# EAGLE design DriverBoard (EAGLE 5.10)
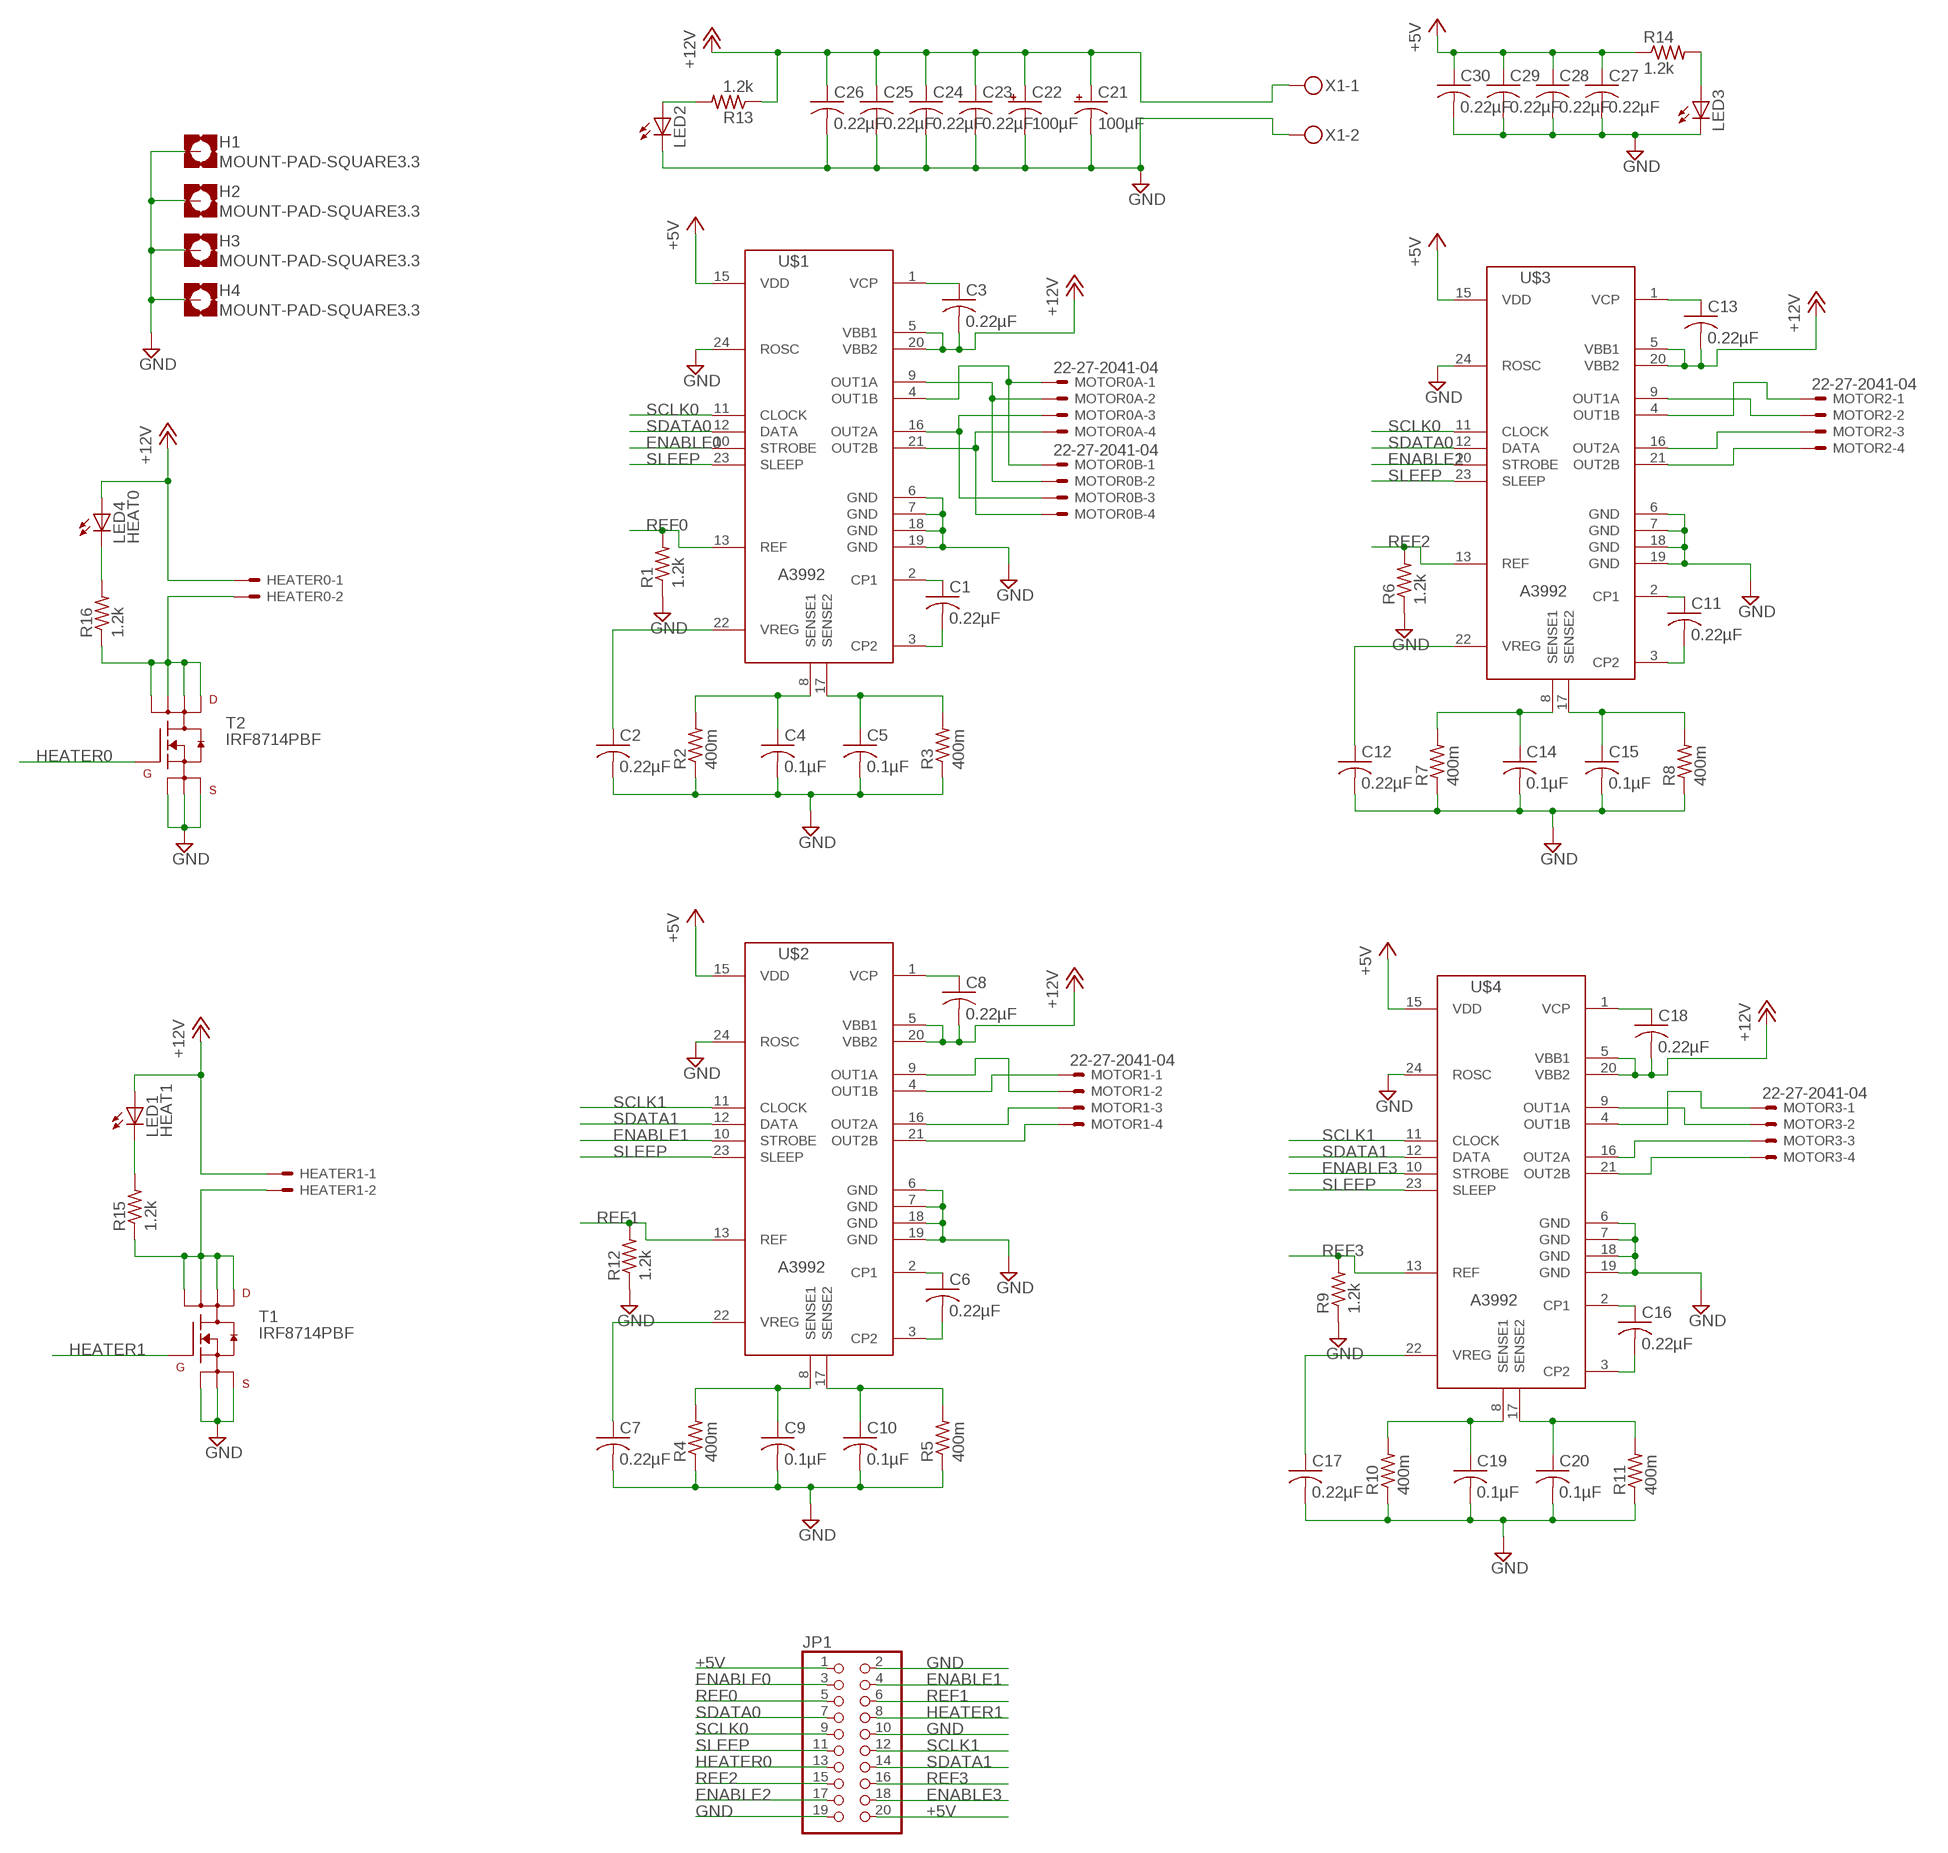
[diagram p0: schematic, sheet 1]

## Parts
C1  0.22µF  C-US050-025X075  [C050-025X075]
C2  0.22µF  C-US050-025X075  [C050-025X075]
C3  0.22µF  C-US050-025X075  [C050-025X075]
C4  0.1µF  C-US050-025X075  [C050-025X075]
C5  0.1µF  C-US050-025X075  [C050-025X075]
C6  0.22µF  C-US050-025X075  [C050-025X075]
C7  0.22µF  C-US050-025X075  [C050-025X075]
C8  0.22µF  C-US050-025X075  [C050-025X075]
C9  0.1µF  C-US050-025X075  [C050-025X075]
C10  0.1µF  C-US050-025X075  [C050-025X075]
C11  0.22µF  C-US050-025X075  [C050-025X075]
C12  0.22µF  C-US050-025X075  [C050-025X075]
C13  0.22µF  C-US050-025X075  [C050-025X075]
C14  0.1µF  C-US050-025X075  [C050-025X075]
C15  0.1µF  C-US050-025X075  [C050-025X075]
C16  0.22µF  C-US050-025X075  [C050-025X075]
C17  0.22µF  C-US050-025X075  [C050-025X075]
C18  0.22µF  C-US050-025X075  [C050-025X075]
C19  0.1µF  C-US050-025X075  [C050-025X075]
C20  0.1µF  C-US050-025X075  [C050-025X075]
C21  100µF  CPOL-USE7.5-16  [E7,5-16]
C22  100µF  CPOL-USE7.5-16  [E7,5-16]
C23  0.22µF  C-US050-025X075  [C050-025X075]
C24  0.22µF  C-US050-025X075  [C050-025X075]
C25  0.22µF  C-US050-025X075  [C050-025X075]
C26  0.22µF  C-US050-025X075  [C050-025X075]
C27  0.22µF  C-US050-025X075  [C050-025X075]
C28  0.22µF  C-US050-025X075  [C050-025X075]
C29  0.22µF  C-US050-025X075  [C050-025X075]
C30  0.22µF  C-US050-025X075  [C050-025X075]
H1  MOUNT-PAD-SQUARE3.3  [3,3-PAD-SQUARE]
H2  MOUNT-PAD-SQUARE3.3  [3,3-PAD-SQUARE]
H3  MOUNT-PAD-SQUARE3.3  [3,3-PAD-SQUARE]
H4  MOUNT-PAD-SQUARE3.3  [3,3-PAD-SQUARE]
HEATER0  22-23-2021  [22-23-2021]
HEATER1  22-23-2021  [22-23-2021]
JP1  PINHD-2X10  [2X10]
LED1  HEAT1  LED5MM  [LED5MM]
LED2  LED5MM  [LED5MM]
LED3  LED5MM  [LED5MM]
LED4  HEAT0  LED5MM  [LED5MM]
MOTOR0A  22-27-2041-04  [6410-04]
MOTOR0B  22-27-2041-04  [6410-04]
MOTOR1  22-27-2041-04  [6410-04]
MOTOR2  22-27-2041-04  [6410-04]
MOTOR3  22-27-2041-04  [6410-04]
R1  1.2k  R-US_0207/7  [0207/7]
R2  400m  R-US_0414/5V  [0414V]
R3  400m  R-US_0414/5V  [0414V]
R4  400m  R-US_0414/5V  [0414V]
R5  400m  R-US_0414/5V  [0414V]
R6  1.2k  R-US_0207/7  [0207/7]
R7  400m  R-US_0414/5V  [0414V]
R8  400m  R-US_0414/5V  [0414V]
R9  1.2k  R-US_0207/7  [0207/7]
R10  400m  R-US_0414/5V  [0414V]
R11  400m  R-US_0414/5V  [0414V]
R12  1.2k  R-US_0207/7  [0207/7]
R13  1.2k  R-US_0207/7  [0207/7]
R14  1.2k  R-US_0207/7  [0207/7]
R15  1.2k  R-US_0207/7  [0207/7]
R16  1.2k  R-US_0207/7  [0207/7]
T1  IRF8714PBF  MOSFET_N_SO8  [SO-08]
T2  IRF8714PBF  MOSFET_N_SO8  [SO-08]
U$1  A3992  [DIL24]
U$2  A3992  [DIL24]
U$3  A3992  [DIL24]
U$4  A3992  [DIL24]
X1  MKDSN1,5/2-5,08  [MKDSN1,5/2-5,08]

## Nets
+5V: C27.1 C28.1 C29.1 C30.1 JP1.1 JP1.20 R14.1 U$1.15(VDD) U$2.15(VDD) U$3.15(VDD) U$4.15(VDD)
+12V: C3.2 C8.2 C13.2 C18.2 C21.+ C22.+ C23.1 C24.1 C25.1 C26.1 HEATER0.1 HEATER1.1 LED1.A LED4.A R13.1 U$1.5(VBB1) U$1.20(VBB2) U$2.5(VBB1) U$2.20(VBB2) U$3.5(VBB1) U$3.20(VBB2) U$4.5(VBB1) U$4.20(VBB2) X1.1
ENABLE0: JP1.3 U$1.10(STROBE)
ENABLE1: JP1.4 U$2.10(STROBE)
ENABLE2: JP1.17 U$3.10(STROBE)
ENABLE3: JP1.18 U$4.10(STROBE)
GND: C2.2 C4.2 C5.2 C7.2 C9.2 C10.2 C12.2 C14.2 C15.2 C17.2 C19.2 C20.2 C21.- C22.- C23.2 C24.2 C25.2 C26.2 C27.2 C28.2 C29.2 C30.2 H1.B3,3(MOUNT) H2.B3,3(MOUNT) H3.B3,3(MOUNT) H4.B3,3(MOUNT) JP1.2 JP1.10 JP1.19 LED2.K(C) LED3.K(C) R1.1 R2.1 R3.1 R4.1 R5.1 R6.1 R7.1 R8.1 R9.1 R10.1 R11.1 R12.1 T1.1(S1) T1.2(S2) T1.3(S3) T2.1(S1) T2.2(S2) T2.3(S3) U$1.6(GND) U$1.7(GND) U$1.18(GND) U$1.19(GND) U$1.24(ROSC) U$2.6(GND) U$2.7(GND) U$2.18(GND) U$2.19(GND) U$2.24(ROSC) U$3.6(GND) U$3.7(GND) U$3.18(GND) U$3.19(GND) U$3.24(ROSC) U$4.6(GND) U$4.7(GND) U$4.18(GND) U$4.19(GND) U$4.24(ROSC) X1.2
HEATER0: JP1.13 T2.4(G)
HEATER1: JP1.8 T1.4(G)
N$1: C1.1 U$1.2(CP1)
N$2: C1.2 U$1.3(CP2)
N$3: MOTOR0A.2 MOTOR0B.2 U$1.9(OUT1A)
N$4: C2.1 U$1.22(VREG)
N$5: MOTOR0A.1 MOTOR0B.1 U$1.4(OUT1B)
N$6: C5.1 R3.2 U$1.17(SENSE2)
N$7: C4.1 R2.2 U$1.8(SENSE1)
N$8: MOTOR0A.3 MOTOR0B.3 U$1.16(OUT2A)
N$9: MOTOR0A.4 MOTOR0B.4 U$1.21(OUT2B)
N$10: C10.1 R5.2 U$2.17(SENSE2)
N$11: C9.1 R4.2 U$2.8(SENSE1)
N$12: C6.1 U$2.2(CP1)
N$13: HEATER1.2 R15.1 T1.5(D1) T1.6(D2) T1.7(D3) T1.8(D4)
N$14: C6.2 U$2.3(CP2)
N$15: LED2.A R13.2
N$16: C7.1 U$2.22(VREG)
N$17: MOTOR1.1 U$2.4(OUT1B)
N$18: MOTOR1.2 U$2.9(OUT1A)
N$19: MOTOR1.3 U$2.16(OUT2A)
N$20: MOTOR1.4 U$2.21(OUT2B)
N$21: C15.1 R8.2 U$3.17(SENSE2)
N$22: C14.1 R7.2 U$3.8(SENSE1)
N$23: C11.1 U$3.2(CP1)
N$24: C11.2 U$3.3(CP2)
N$25: LED1.K(C) R15.2
N$26: C12.1 U$3.22(VREG)
N$27: MOTOR2.2 U$3.9(OUT1A)
N$28: MOTOR2.1 U$3.4(OUT1B)
N$29: MOTOR2.3 U$3.16(OUT2A)
N$30: MOTOR2.4 U$3.21(OUT2B)
N$31: C20.1 R11.2 U$4.17(SENSE2)
N$32: C19.1 R10.2 U$4.8(SENSE1)
N$33: C16.1 U$4.2(CP1)
N$34: C16.2 U$4.3(CP2)
N$35: LED3.A R14.2
N$36: C17.1 U$4.22(VREG)
N$37: MOTOR3.2 U$4.9(OUT1A)
N$38: MOTOR3.1 U$4.4(OUT1B)
N$39: MOTOR3.3 U$4.16(OUT2A)
N$40: MOTOR3.4 U$4.21(OUT2B)
N$41: HEATER0.2 R16.1 T2.5(D1) T2.6(D2) T2.7(D3) T2.8(D4)
N$42: LED4.K(C) R16.2
REF0: JP1.5 R1.2 U$1.13(REF)
REF1: JP1.6 R12.2 U$2.13(REF)
REF2: JP1.15 R6.2 U$3.13(REF)
REF3: JP1.16 R9.2 U$4.13(REF)
SCLK0: JP1.9 U$1.11(CLOCK) U$3.11(CLOCK)
SCLK1: JP1.12 U$2.11(CLOCK) U$4.11(CLOCK)
SDATA0: JP1.7 U$1.12(DATA) U$3.12(DATA)
SDATA1: JP1.14 U$2.12(DATA) U$4.12(DATA)
SLEEP: JP1.11 U$1.23(SLEEP) U$2.23(SLEEP) U$3.23(SLEEP) U$4.23(SLEEP)
VCP1: C3.1 U$1.1(VCP)
VCP2: C8.1 U$2.1(VCP)
VCP3: C13.1 U$3.1(VCP)
VCP4: C18.1 U$4.1(VCP)

## Library data of the parts
C1-C20 C23-C30 = rcl:C-US: CAPACITOR, American symbol
C21 C22 = rcl:CPOL-US: POLARIZED CAPACITOR, American symbol
H1-H4 = holes:MOUNT-PAD-SQUARE: MOUNTING PAD, square
HEATER0 HEATER1 = con-molex:22-23-2021: .100" (2.54mm) Center Header - 2 Pin
JP1 = pinhead:PINHD-2X10: PIN HEADER
LED1-LED4 = led:LED: LED OSRAM: - CHIPLED LG R971, LG N971, LY N971, LG Q971, LY Q971, LO R971, LY R971 LH N974, LH R974 LS Q976, LO Q976, LY Q976 LO Q996 - Hyper CHIPLED LW Q18S LB Q993, LB Q99A, LB R99A - SideLED LS A670, LO A670, LY A670, LG A670, LP A670 LB A673, LV A673, LT A673, LW A673 LH A674 LY A675 LS A676, LA A676, LO A676, LY A676, LW A676 LS A679, LY A679, LG A679 - Hyper Micro SIDELED® LS Y876, LA Y876, LO Y876, LY Y876 LT Y87S - SmartLED LW L88C, LW L88S LB L89C, LB L89S, LG L890 LS L89K, LO L89K, LY L89K LS L896, LA L896, LO L896, LY L896 - TOPLED LS T670, LO T670, LY T670, LG T670, LP T670 LSG T670, LSP T670, LSY T670, LOP T670, LYG T670 LG T671, LOG T671, LSG T671 LB T673, LV T673, LT T673, LW T673 LH T674 LS T676, LA T676, LO T676, LY T676, LB T676, LH T676, LSB T676, LW T676 LB T67C, LV T67C, LT T67C, LS T67K, LO T67K, LY T67K, LW E67C LS E67B, LA E67B, LO E67B, LY E67B, LB E67C, LV E67C, LT E67C LW T67C LS T679, LY T679, LG T679 LS T770, LO T770, LY T770, LG T770, LP T770 LB T773, LV T773, LT T773, LW T773 LH T774 LS E675, LA E675, LY E675, LS T675 LS T776, LA T776, LO T776, LY T776, LB T776 LHGB T686 LT T68C, LB T68C - Hyper Mini TOPLED® LB M676 - Mini TOPLED Santana® LG M470 LS M47K, LO M47K, LY M47K Source: http://www.osram.convergy.de LUXEON: - LUMILED® LXK2-PW12-R00, LXK2-PW12-S00, LXK2-PW14-U00, LXK2-PW14-V00 LXK2-PM12-R00, LXK2-PM12-S00, LXK2-PM14-U00 LXK2-PE12-Q00, LXK2-PE12-R00, LXK2-PE12-S00, LXK2-PE14-T00, LXK2-PE14-U00 LXK2-PB12-K00, LXK2-PB12-L00, LXK2-PB12-M00, LXK2-PB14-N00, LXK2-PB14-P00, LXK2-PB14-Q00 LXK2-PR12-L00, LXK2-PR12-M00, LXK2-PR14-Q00, LXK2-PR14-R00 LXK2-PD12-Q00, LXK2-PD12-R00, LXK2-PD12-S00 LXK2-PH12-R00, LXK2-PH12-S00 LXK2-PL12-P00, LXK2-PL12-Q00, LXK2-PL12-R00 Source: www.luxeon.com KINGBRIGHT: KA-3528ASYC Source: www.kingbright.com
MOTOR0A MOTOR0B MOTOR1-MOTOR3 = con-molex:22-?-04: CONNECTOR wire to board 2.54 mm (.1 inch) pitch header
R1-R13 R15 R16 = rcl:R-US_: RESISTOR, American symbol
R14 = resistor:R-US_: RESISTOR, American symbol
T1 T2 = eje-components:MOSFET_N_SO8
U$1-U$4 = allegro:A3992: A3992 Motor Controller
X1 = con-phoenix-508:MKDSN1,5/2-5,08: MKDSN 1,5/ 2-5,08 Printklemme Nennstrom: 13,5 A Nennspannung: 250 V Rastermaß: 5,08 mm Polzahl: 2 Anschlussart: Schraubanschluss Montage: Löten Anschlussrichtung Leiter/Platine: 0 ° Artikelnummer: 1729128 Source: http://eshop.phoenixcontact.com .. 1729128.pdf

## Board
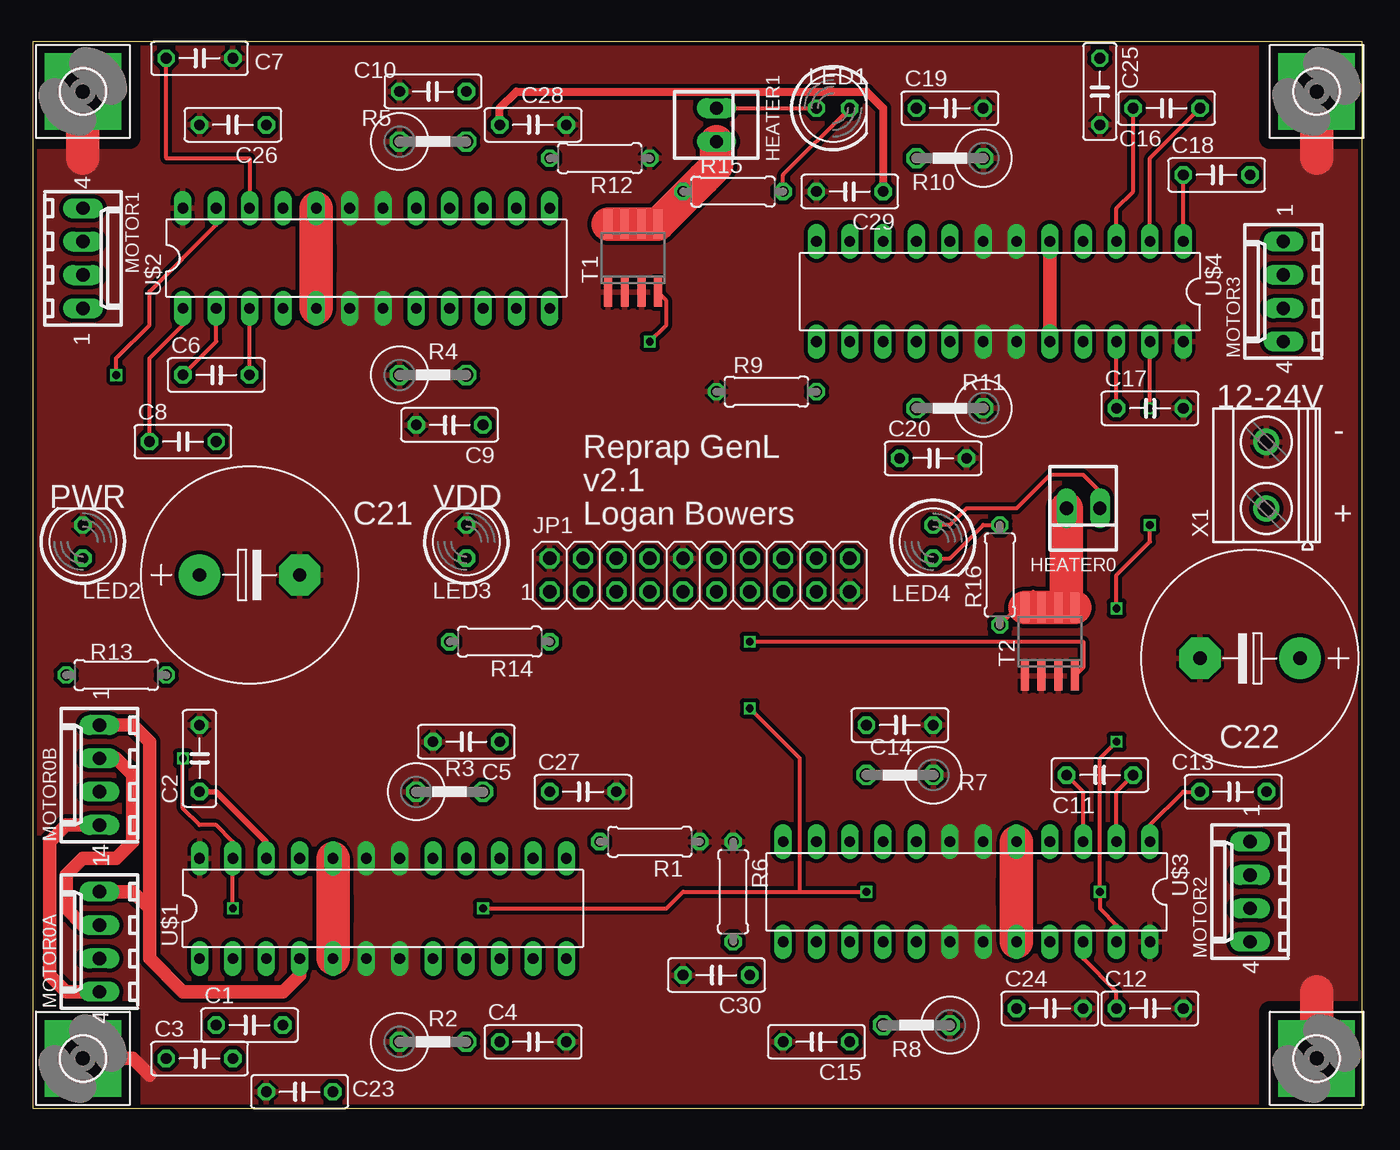
[diagram p1: board, top side]
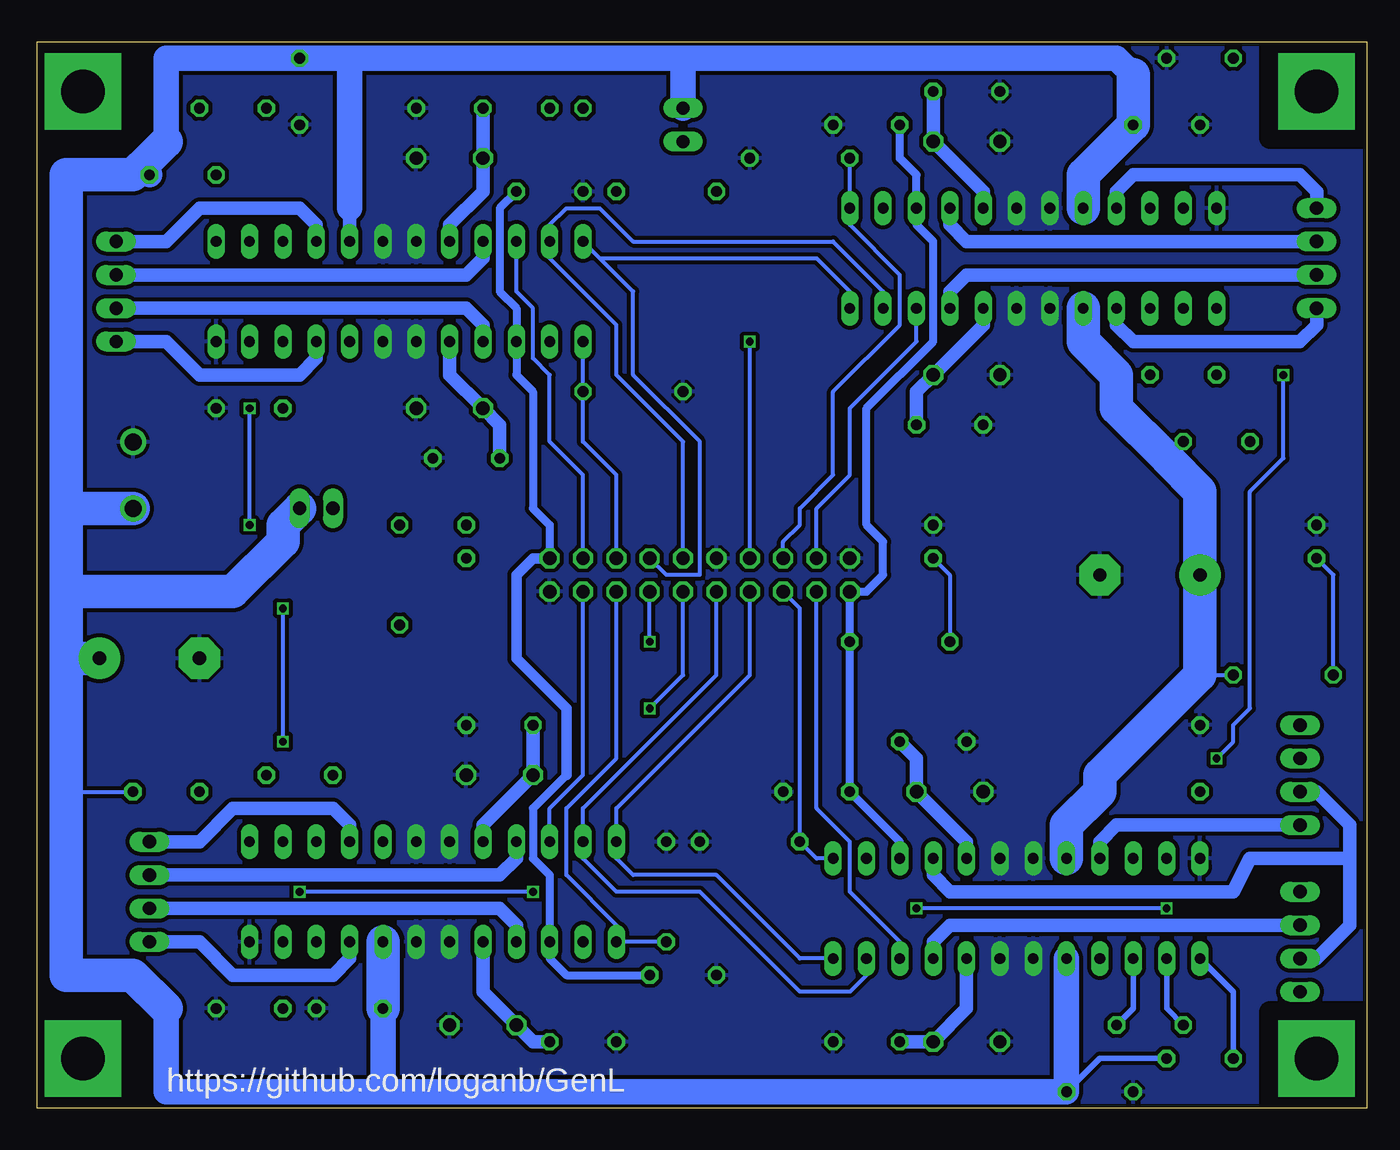
[diagram p2: board, bottom side, seen from below]

Size 101.27 x 81.27 mm. Coordinates in mm from the lower left corner, seen from the top.
Outline: 0,0 101.27,0 101.27,81.27 0,81.27 0,0
Copper layers (1*16): Top 0.035mm / dielectric 1.5mm / Bottom 0.035mm
Design rules "ITead_rule": minimum track width 6mil, minimum drill 12mil, track to track 6mil, track to pad 6mil, pad to pad 6mil, via to via 6mil, smd to smd 0mil, copper to edge 10mil, drill to drill 10mil, minimum pad ring 10mil, minimum via ring 6mil, stop-mask expansion 2mil, vias tented up to drill 100mil, thermal gap 10mil

### Footprints (pad centres in the part's own frame; a part is rotated, then mirrored left to right if it is on the bottom)
C050-025X075 = drill 0.813 octagon: 1 -2.54,0; 2 2.54,0
E7,5-16 = drill 1.016 pad 3.15 round: + -3.81,0 | drill 1.016 pad 3.15 octagon: - 3.81,0
3,3-PAD-SQUARE = drill 3.3 pad 5.842 square: B3,3 0,0
22-23-2021 = drill 1 long: 1 -1.27,0; 2 1.27,0
2X10 = drill 1.016 octagon: 1 -11.43,-1.27; 2 -11.43,1.27; 3 -8.89,-1.27; 4 -8.89,1.27; 5 -6.35,-1.27; 6 -6.35,1.27; 7 -3.81,-1.27; 8 -3.81,1.27; 9 -1.27,-1.27; 10 -1.27,1.27; 11 1.27,-1.27; 12 1.27,1.27; 13 3.81,-1.27; 14 3.81,1.27; 15 6.35,-1.27; 16 6.35,1.27; 17 8.89,-1.27; 18 8.89,1.27; 19 11.43,-1.27; 20 11.43,1.27
LED5MM = drill 0.813 octagon: A -1.27,0; K 1.27,0
6410-04 = drill 1.016 long: 1 3.81,0; 2 1.27,0; 3 -1.27,0; 4 -3.81,0
0207/7 = drill 0.813 octagon: 1 -3.81,0; 2 3.81,0
0414V = drill 1.016 octagon: 1 -2.54,0; 2 2.54,0
SO-08 = smd 0.6 x 2.2: 1 -1.905,-2.6; 2 -0.635,-2.6; 3 0.635,-2.6; 4 1.905,-2.6; 5 1.905,2.6; 6 0.635,2.6; 7 -0.635,2.6; 8 -1.905,2.6
DIL24 = drill 0.813 long: 1 -11.43,-3.81; 2 -8.89,-3.81; 3 -6.35,-3.81; 4 -3.81,-3.81; 5 -1.27,-3.81; 6 1.27,-3.81; 7 3.81,-3.81; 8 6.35,-3.81; 9 8.89,-3.81; 10 11.43,-3.81; 11 13.97,-3.81; 12 16.51,-3.81; 13 16.51,3.81; 14 13.97,3.81; 15 11.43,3.81; 16 8.89,3.81; 17 6.35,3.81; 18 3.81,3.81; 19 1.27,3.81; 20 -1.27,3.81; 21 -3.81,3.81; 22 -6.35,3.81; 23 -8.89,3.81; 24 -11.43,3.81
MKDSN1,5/2-5,08 = drill 1.3 pad 2 round: 1 -2.561,0.025; 2 2.519,0.025

### Placement (x,y rotation side)
C1  16.51,6.35 0 top
C2  12.7,26.67 90 top
C3  12.7,3.81 0 top
C4  38.1,5.08 0 top
C5  33.02,27.94 180 top
C6  13.97,55.88 0 top
C7  12.7,80.01 0 top
C8  11.43,50.8 0 top
C9  31.75,52.07 180 top
C10  30.48,77.47 180 top
C11  81.28,25.4 180 top
C12  85.09,7.62 0 top
C13  91.44,24.13 0 top
C14  66.04,29.21 0 top
C15  59.69,5.08 180 top
C16  86.36,76.2 180 top
C17  85.09,53.34 0 top
C18  90.17,71.12 0 top
C19  69.85,76.2 0 top
C20  68.58,49.53 0 top
C21  16.51,40.64 0 top
C22  92.71,34.29 180 top
C23  20.32,1.27 180 top
C24  77.47,7.62 0 top
C25  81.28,77.47 270 top
C26  15.24,74.93 180 top
C27  41.91,24.13 0 top
C28  38.1,74.93 0 top
C29  62.23,69.85 180 top
C30  52.07,10.16 180 top
H1  3.81,3.81 0 top
H2  97.79,77.47 0 top
H3  97.79,3.81 0 top
H4  3.81,77.47 0 top
HEATER0  80.01,45.72 180 top
HEATER1  52.07,74.93 270 top
JP1  50.8,40.64 0 top
LED1  60.96,76.2 0 top
LED2  3.81,43.18 90 top
LED3  33.02,43.18 90 top
LED4  68.58,43.18 270 top
MOTOR0A  5.08,12.7 90 top
MOTOR0B  5.08,25.4 90 top
MOTOR1  3.81,64.77 270 top
MOTOR2  92.71,16.51 90 top
MOTOR3  95.25,62.23 90 top
R1  46.99,20.32 180 top
R2  30.48,5.08 0 top
R3  31.75,24.13 0 top
R4  30.48,55.88 0 top
R5  30.48,73.66 0 top
R6  53.34,16.51 270 top
R7  66.04,25.4 180 top
R8  67.31,6.35 180 top
R9  55.88,54.61 0 top
R10  69.85,72.39 180 top
R11  69.85,53.34 180 top
R12  43.18,72.39 180 top
R13  6.35,33.02 180 top
R14  35.56,35.56 180 top
R15  53.34,69.85 0 top
R16  73.66,40.64 90 top
T1  45.72,64.77 0 top
T2  77.47,35.56 0 top
U$1  24.13,15.24 0 top
U$2  22.86,64.77 0 top
U$3  73.66,16.51 180 top
U$4  76.2,62.23 180 top
X1  93.98,48.26 90 top

### Tracks (layer width: path | path; a pad name or v marks a point on that pad's centre or on a via)
+5V
  Top 0.61: C28.1 35.56,76.2 36.83,77.47 63.5,77.47 64.77,76.2 C29.1
  Bottom 0.305: 34.29,71.12 U$2.15
  Bottom 0.61: C30.1 60.96,10.16 62.23,11.43 U$3.15 62.23,17.78 63.5,19.05 63.5,22.86 60.96,25.4 | U$1.15 35.56,20.32 C27.1 R14.1 JP1.1 38.1,39.37 36.83,40.64 36.83,43.18 38.1,44.45 38.1,53.34 33.02,58.42 33.02,66.04 34.29,67.31 34.29,71.12 35.56,72.39 C28.1 | C29.1 66.04,68.58 66.04,62.23 64.77,60.96 U$4.15 64.77,55.88 63.5,54.61 63.5,45.72 62.23,44.45 JP1.20
  Bottom 0.813: JP1.20 63.5,41.91 64.77,40.64 64.77,34.29 60.96,30.48 60.96,25.4
+12V
  Top 0.305: LED4.A 69.85,44.45 71.12,45.72 74.93,45.72 77.47,48.26 80.01,48.26 81.28,46.99 HEATER0.1 | HEATER1.1 LED1.A
  Top 1.016: U$4.5 U$4.20
  Top 2.54: U$2.5 U$2.20 | U$1.5 U$1.20 | U$3.20 U$3.5
  Bottom 0.305: 99.06,24.13 C13.2 | 15.24,49.53 C8.2 | 12.7,33.02 R13.1
  Bottom 0.406: C3.2 20.32,3.81 C23.1
  Bottom 1.016: U$2.20 21.59,69.85 | 77.47,68.58 U$4.5
  Bottom 1.93: 91.44,73.66 91.44,80.01 C25.1 | 52.07,80.01 19.05,80.01 17.78,78.74 | C25.1 52.07,80.01 | 52.07,80.01 HEATER1.1 | 77.47,68.58 77.47,80.01 C25.1 | 93.34,71.75 C18.2 | 91.44,7.62 91.44,1.27 74.93,1.27 | 74.93,1.27 C23.1 U$1.5 | 74.93,1.27 C24.1
  Bottom 2.54: C24.1 U$3.20 | U$2.5 21.59,58.42 19.05,55.88 19.05,53.34 15.24,49.53 12.7,46.99 C21.+ 12.7,33.02 20.32,25.4 20.32,24.13 22.86,21.59 U$1.20 | U$2.20 21.59,71.12 C26.1 17.78,78.74 | 91.44,73.66 93.34,71.75 93.98,71.12 99.06,71.12 99.06,45.7 | 99.06,34.29 99.06,39.37 | 99.06,39.37 99.06,45.7 | 99.06,34.29 99.06,24.13 99.06,10.16 93.98,10.16 91.44,7.62 | 99.06,45.7 X1.1 | 99.06,34.29 C22.+ | HEATER0.1 82.55,44.45 82.55,43.18 86.36,39.37 99.06,39.37
ENABLE0
  Bottom 0.305: JP1.3 41.91,22.86 39.37,20.32 39.37,16.51 35.56,12.7 U$1.10
ENABLE1
  Bottom 0.305: JP1.4 41.91,45.72 39.37,48.26 39.37,53.34 34.29,58.42 U$2.10
ENABLE2
  Bottom 0.305: U$3.10 62.23,22.86 59.69,25.4 JP1.17
ENABLE3
  Bottom 0.305: JP1.18 59.69,48.26 62.23,50.8 62.23,55.88 63.5,57.15 63.5,60.96 64.77,62.23 U$4.10
GND
  Top 1.016: H1.B3,3 7.62,3.81 8.89,2.54
  Top 2.54: 3.81,72.39 H4.B3,3 | H3.B3,3 97.79,8.89 | 97.79,72.39 H2.B3,3
  pour Top (isolate 0.305): -2.54,82.55 102.87,82.55 102.87,-1.27 -2.54,-1.27
  pour Bottom (isolate 0.305): -3.81,83.82 104.14,83.82 104.14,-2.54 -3.81,-2.54
  pour Top (isolate 0.254, no thermals): 22.86,58.42 22.86,63.5 27.94,63.5 27.94,58.42
  pour Top (isolate 0.254, no thermals): 22.86,66.04 22.86,71.12 27.94,71.12 27.94,66.04
  pour Top (isolate 0.254, no thermals): 24.13,16.51 24.13,21.59 29.21,21.59 29.21,16.51
  pour Top (isolate 0.254, no thermals): 24.13,8.89 24.13,13.97 29.21,13.97 29.21,8.89
  pour Top (isolate 0.254, no thermals): 68.58,17.78 68.58,22.86 73.66,22.86 73.66,17.78
  pour Top (isolate 0.254, no thermals): 68.58,10.16 68.58,15.24 73.66,15.24 73.66,10.16
  pour Top (isolate 0.254, no thermals): 71.12,55.88 71.12,60.96 76.2,60.96 76.2,55.88
  pour Top (isolate 0.254, no thermals): 71.12,63.5 71.12,68.58 76.2,68.58 76.2,63.5
  pour Bottom (isolate 0.381, no thermals): 22.86,71.12 27.94,71.12 27.94,58.42 22.86,58.42
  pour Bottom (isolate 0.381, no thermals): 24.13,21.59 29.21,21.59 29.21,8.89 24.13,8.89
  pour Bottom (isolate 0.381, no thermals): 68.58,22.86 73.66,22.86 73.66,10.16 68.58,10.16
  pour Bottom (isolate 0.381, no thermals): 71.12,68.58 76.2,68.58 76.2,55.88 71.12,55.88
HEATER0  (via drill 0.6)
  Top 0.305: T2.4 80.01,33.59 80.01,35.56 v54.61,35.56
  Bottom 0.305: v54.61,35.56 JP1.13
HEATER1  (via drill 0.6)
  Top 0.305: v46.99,58.42 48.26,59.69 48.26,61.53 T1.4
  Bottom 0.305: JP1.8 v46.99,58.42
N$1
  Bottom 0.406: C1.1 15.24,7.62 U$1.2
N$2
  Bottom 0.406: C1.2 17.78,7.62 U$1.3
N$3
  Top 1.016: MOTOR0B.2 6.35,26.67 7.62,25.4 7.62,20.32 6.35,19.05 3.81,19.05 2.54,17.78 2.54,15.24 3.81,13.97 MOTOR0A.2
  Bottom 1.016: U$1.9 33.02,12.7 31.75,13.97 MOTOR0A.2
N$4
  Top 0.406: U$1.22 17.78,20.32 13.97,24.13 C2.1
N$5
  Top 1.016: U$1.4 20.32,10.16 19.05,8.89 11.43,8.89 8.89,11.43 8.89,15.24 | MOTOR0A.1 7.62,16.51 8.89,15.24 | MOTOR0B.1 7.62,29.21 8.89,27.94 8.89,15.24
N$6
  Bottom 1.016: U$1.17 30.48,20.32 R3.2 34.29,26.67 C5.1
N$7
  Bottom 1.016: U$1.8 30.48,7.62 R2.2 C4.1
N$8
  Bottom 1.016: U$1.16 33.02,17.78 31.75,16.51 10.16,16.51 8.89,19.05 1.27,19.05 | 1.27,19.05 1.27,21.59 3.81,24.13 MOTOR0B.3 | 1.27,19.05 1.27,13.97 3.81,11.43 MOTOR0A.3
N$9
  Top 1.016: MOTOR0B.4 2.54,21.59 1.27,20.32 1.27,10.16 2.54,8.89 MOTOR0A.4
  Bottom 1.016: U$1.21 20.32,20.32 19.05,21.59 MOTOR0B.4
N$10
  Bottom 1.016: U$2.17 29.21,69.85 R5.2 C10.1
N$11
  Bottom 1.016: U$2.8 29.21,59.69 R4.2 34.29,54.61 C9.1
N$12
  Top 0.305: U$2.2 13.97,58.42 C6.1
N$13
  Top 0.305: R15.1 50.74,70.48 51.09,70.83
  Top 2.54: HEATER1.2 52.07,71.81 51.09,70.83 T1.5 T1.6 T1.7 T1.8
N$14
  Top 0.305: C6.2 U$2.3
N$15
  Bottom 0.305: R13.2 2.54,40.64 LED2.A
N$16
  Top 0.305: C7.1 10.16,72.39 16.51,72.39 U$2.22
N$17
  Bottom 1.016: U$2.4 19.05,59.69 17.78,58.42 5.08,58.42 3.81,59.69 MOTOR1.1
N$18
  Bottom 1.016: U$2.9 31.75,62.23 30.48,63.5 MOTOR1.2
N$19
  Bottom 1.016: U$2.16 31.75,67.31 30.48,66.04 MOTOR1.3
N$20
  Bottom 1.016: U$2.21 19.05,69.85 17.78,71.12 5.08,71.12 3.81,69.85 MOTOR1.4
N$21
  Bottom 1.016: U$3.17 67.31,8.89 R8.2 63.5,5.08 C15.1
N$22
  Bottom 1.016: U$3.8 67.31,21.59 R7.2 C14.1
N$23
  Top 0.305: U$3.2 82.55,24.13 C11.1
N$24
  Top 0.305: U$3.3 80.01,24.13 C11.2
N$25
  Top 0.305: R15.2 57.15,71.12 LED1.K
N$26
  Top 0.305: U$3.22 80.01,11.43 82.55,8.89 C12.1
N$27
  Bottom 1.016: MOTOR2.2 66.04,17.78 64.77,19.05 U$3.9
N$28
  Bottom 1.016: MOTOR2.1 88.9,20.32 86.36,22.86 78.74,22.86 77.47,21.59 U$3.4
N$29
  Bottom 1.016: U$3.16 64.77,13.97 66.04,15.24 MOTOR2.3
N$30
  Bottom 1.016: MOTOR2.4 88.9,12.7 86.36,10.16 78.74,10.16 77.47,11.43 U$3.21
N$31
  Bottom 1.016: U$4.17 69.85,55.88 R11.2 66.04,52.07 C20.1
N$32
  Bottom 1.016: C19.1 R10.2 67.31,69.85 69.85,67.31 U$4.8
N$33
  Top 0.305: U$4.2 85.09,72.39 C16.1
N$34
  Top 0.305: U$4.3 82.55,68.58 83.82,69.85 C16.2
N$35
  Bottom 0.305: LED3.A 31.75,40.64 R14.2
N$36
  Top 0.305: C17.1 U$4.22
N$37
  Bottom 1.016: U$4.9 67.31,64.77 68.58,63.5 MOTOR3.2
N$38
  Bottom 1.016: U$4.4 80.01,67.31 81.28,68.58 88.9,68.58 91.44,66.04 MOTOR3.1
N$39
  Bottom 1.016: U$4.16 67.31,59.69 68.58,60.96 MOTOR3.3
N$40
  Bottom 1.016: U$4.21 80.01,57.15 81.28,55.88 88.9,55.88 91.44,58.42 MOTOR3.4
N$41
  Top 0.305: R16.1 76.2,39.37 76.2,38.16
  Top 2.54: 78.74,38.16 T2.6 T2.7 76.2,38.16 T2.8 | 78.74,38.16 T2.5 | 78.74,38.16 HEATER0.2
N$42
  Top 0.305: LED4.K 69.85,41.91 72.39,44.45 R16.2
REF0
  Bottom 0.305: U$1.13 41.91,19.05 R1.2 43.18,38.1 JP1.5
REF1
  Bottom 0.305: R12.2 U$2.13 39.37,67.31 35.56,63.5 35.56,59.69 40.64,54.61 40.64,48.26 43.18,45.72 43.18,44.45 44.45,43.18 JP1.6
REF2
  Bottom 0.305: JP1.15 57.15,26.67 60.96,22.86 60.96,17.78 57.15,13.97 U$3.13 R6.2
REF3
  Bottom 0.305: U$4.13 R9.2 59.69,50.8 57.15,48.26 JP1.16
SCLK0
  Bottom 0.305: JP1.9 49.53,33.02 59.69,22.86 U$3.11 59.69,19.05 57.15,16.51 50.8,16.51 43.18,8.89 39.37,8.89 38.1,10.16 U$1.11
SCLK1
  Bottom 0.305: U$2.11 36.83,62.23 40.64,66.04 55.88,66.04 58.42,68.58 60.96,68.58 62.23,67.31 U$4.11 62.23,64.77 57.15,59.69 57.15,55.88 52.07,50.8 JP1.12
SDATA0
  Bottom 0.305: JP1.7 46.99,33.02 57.15,22.86 U$3.12 57.15,19.05 55.88,17.78 49.53,17.78 43.18,11.43 U$1.12
SDATA1
  Bottom 0.305: JP1.14 53.34,40.64 50.8,40.64 50.8,50.8 55.88,55.88 55.88,62.23 58.42,64.77 | U$2.12 39.37,62.23 41.91,64.77 58.42,64.77 | 58.42,64.77 U$4.12
SLEEP  (via drill 0.6)
  Top 0.305: U$3.23 82.55,13.97 81.28,15.24 v81.28,16.51 81.28,26.67 v82.55,27.94 | 58.42,16.51 49.53,16.51 48.26,15.24 v34.29,15.24 | 58.42,16.51 v63.5,16.51 | v15.24,15.24 U$1.23 15.24,20.32 13.97,21.59 12.7,21.59 11.43,22.86 v11.43,26.67 | U$2.23 13.97,67.31 8.89,62.23 8.89,59.69 6.35,57.15 v6.35,55.88 | v85.09,44.45 85.09,43.18 82.55,40.64 v82.55,38.1 | v85.09,53.34 U$4.23 | v54.61,30.48 58.42,26.67 58.42,16.51
  Bottom 0.305: v63.5,16.51 v81.28,16.51 | v15.24,15.24 v34.29,15.24 | v6.35,55.88 6.35,49.53 8.89,46.99 8.89,30.48 10.16,29.21 10.16,27.94 v11.43,26.67 | v85.09,44.45 v85.09,53.34 | v82.55,27.94 v82.55,38.1 | JP1.11 52.07,33.02 v54.61,30.48
VCP1
  Bottom 0.406: C3.1 10.16,8.89 U$1.1
VCP2
  Top 0.305: U$2.1 11.43,59.69 8.89,57.15 C8.1
VCP3
  Top 0.305: U$3.1 85.09,21.59 87.63,24.13 C13.1
VCP4
  Top 0.305: U$4.1 C18.1

### Text on the board
tNames: 12-24V | - | Reprap GenL | v2.1 | PWR | VDD | Logan Bowers | +
bNames: https://github.com/loganb/GenL